# EAGLE schematic MSP-EXP430FR5739_1_1_4 (EAGLE 6.2)
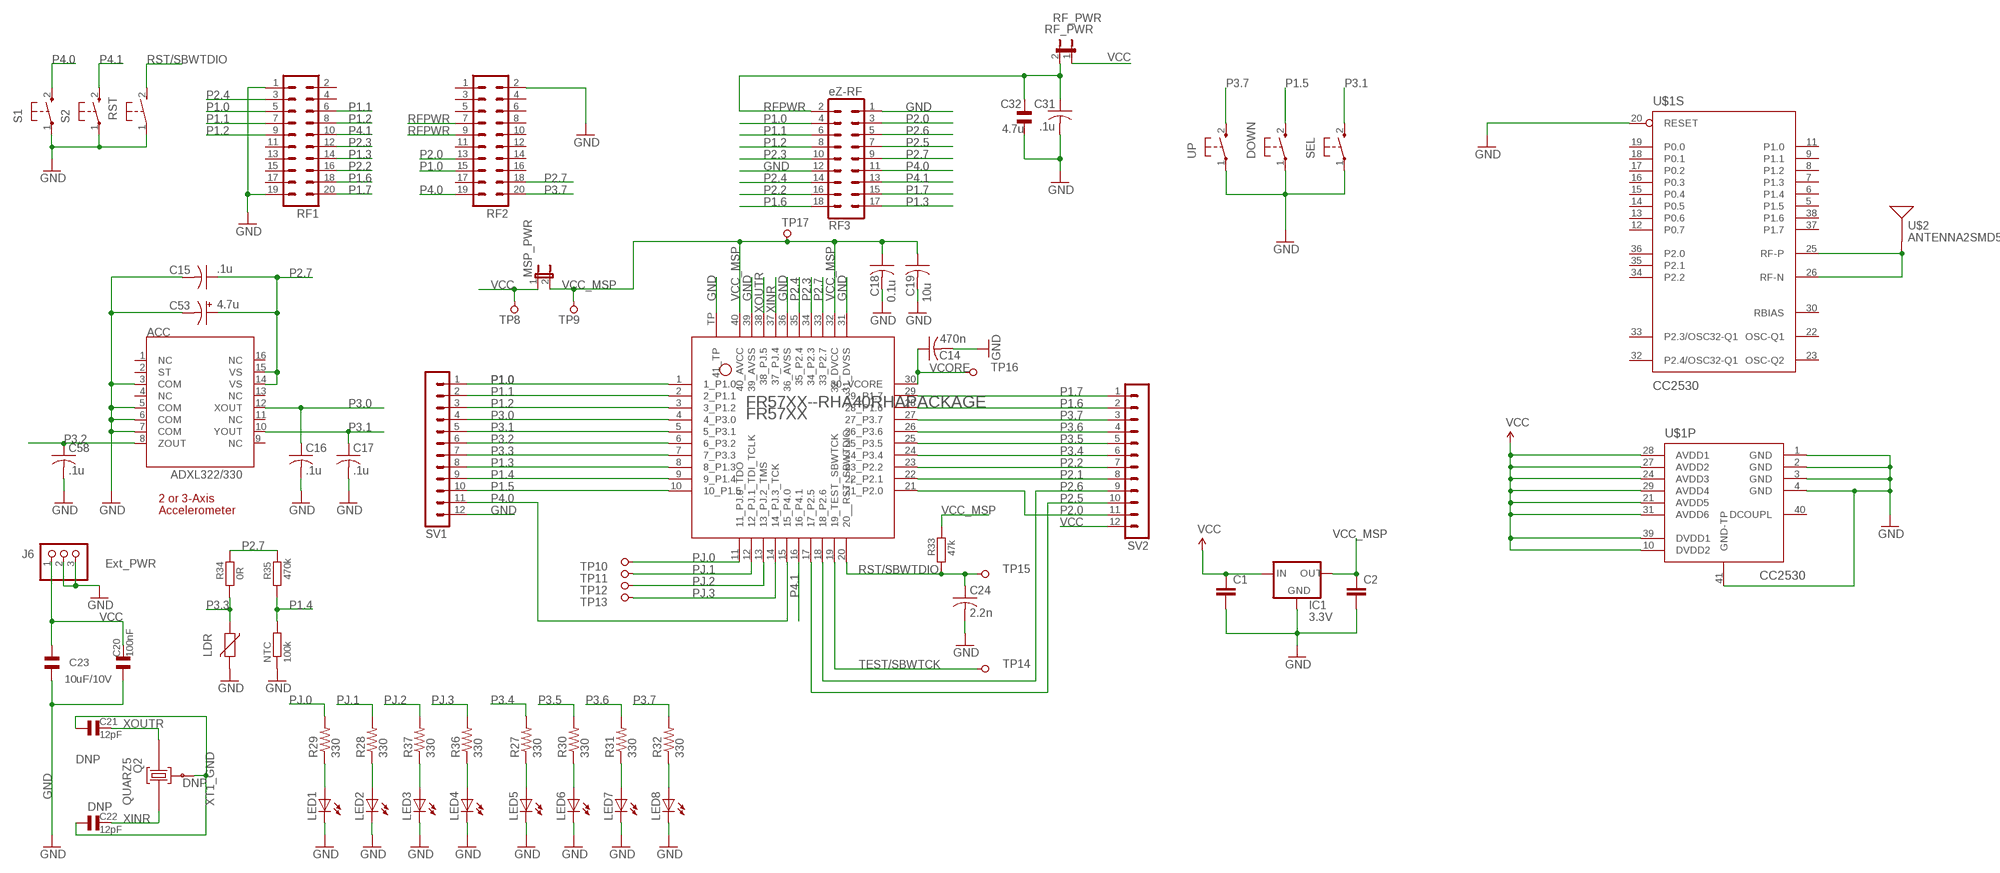
[diagram p0: schematic, sheet 1]

## Parts
ACC  ADXL322/330  ADXL330  [RSA16]
C1  CAPPTH1  [CAP-PTH-5MM]
C2  CAPPTH1  [CAP-PTH-5MM]
C14  470n  C-USC0603  [C0603]
C15  .1u  C-USC0603  [C0603]
C16  .1u  C-USC0603  [C0603]
C17  .1u  C-USC0603  [C0603]
C18  0.1u  C-USC0603  [C0603]
C19  10u  C-USC0603  [C0603]
C20  100nF  C_SMD0603  [0603]
C21  12pF  C_SMD0603  [0603]
C22  12pF  C_SMD0603  [0603]
C23  10uF/10V  C_0805  [0805]
C24  2.2n  C-USC0603  [C0603]
C31  .1u  C-USC0603  [C0603]
C32  4.7u  CSMD0805  [CSMD0805]
C53  4.7u  CPOL-USSMCA  [SMC_A]
C58  .1u  C-USC0603  [C0603]
DOWN  PB  [PBTH]
FR57XX  FR57XX--RHA40RHAPACKAGE  [RHA40]
IC1  3.3V  78LXX  [78LXX]
J6  PINHD-1X3  [1X03]
LDR  R3,4  [R-3,4]
LED1  LEDCHIPLED_0603  [CHIPLED_0603]
LED2  LEDCHIPLED_0603  [CHIPLED_0603]
LED3  LEDCHIPLED_0603  [CHIPLED_0603]
LED4  LEDCHIPLED_0603  [CHIPLED_0603]
LED5  LEDCHIPLED_0603  [CHIPLED_0603]
LED6  LEDCHIPLED_0603  [CHIPLED_0603]
LED7  LEDCHIPLED_0603  [CHIPLED_0603]
LED8  LEDCHIPLED_0603  [CHIPLED_0603]
MSP_PWR  JP1E  [JP1]
NTC  100k  R_0805  [0805]
Q2  QUARZ5  [QUARZ5]
R27  330  R-US_R0603  [R0603]
R28  330  R-US_R0603  [R0603]
R29  330  R-US_R0603  [R0603]
R30  330  R-US_R0603  [R0603]
R31  330  R-US_R0603  [R0603]
R32  330  R-US_R0603  [R0603]
R33  47k  R_SMDR0603  [0603]
R34  0R  R_SMDR0603  [0603]
R35  470k  R_SMDR0603  [0603]
R36  330  R-US_R0603  [R0603]
R37  330  R-US_R0603  [R0603]
RF1  TFM-110-02-SM-D-A-K  [TFM-110-02-SM-D-A-K]
RF2  TFM-110-02-SM-D-A-K  [TFM-110-02-SM-D-A-K]
RF3  eZ-RF  MA09-2  [MA09-2]
RF_PWR  RF_PWR  JP1E  [JP1]
RST  EVQPPDASTD  [EVQPPDA]
S1  PB  [PBTH]
S2  PB  [PBTH]
SEL  PB  [PBTH]
SV1  MA12-1  [MA12-1]
SV2  MA12-1  [MA12-1]
TP8  TP05TP10  [TP10]
TP9  TP05TP10  [TP10]
TP10  TP05TP10  [TP10]
TP11  TP05TP10  [TP10]
TP12  TP05TP10  [TP10]
TP13  TP05TP10  [TP10]
TP14  TP05TP10  [TP10]
TP15  TP05TP10  [TP10]
TP16  TP05TP10  [TP10]
TP17  TP05TP10  [TP10]
U$1  CC2530  [QFN50P600X600X100-41N]
U$2  ANTENNA2SMD5  [ANTENNA-CHIP5]
UP  PB  [PBTH]

## Nets
GND [Ground]: ACC.3(COM) ACC.5(COM) ACC.6(COM) ACC.7(COM) C1.2 C2.2 C14.2 C15.2 C16.2 C17.2 C18.2 C19.2 C20.1 C23.1 C24.2 C31.2 C32.2 C53.- C58.2 DOWN.1(P) FR57XX.31(31_DVSS) FR57XX.36(36_AVSS) FR57XX.39(39_AVSS) FR57XX.TP(41_TP) IC1.GND J6.2 J6.3 LDR.2 LED1.C LED2.C LED3.C LED4.C LED5.C LED6.C LED7.C LED8.C NTC.1 RF1.1 RF1.19 RF2.2 RF3.1 RF3.12 RST.1(P) S1.1(P) S2.1(P) SEL.1(P) SV1.12 U$1.1(GND) U$1.2(GND) U$1.3(GND) U$1.4(GND) U$1.20(RESET) U$1.41(GND-TP) UP.1(P)
N$1: U$1.25(RF-P) U$1.26(RF-N) U$2.FEED(SIGNAL)
N$7: LED6.A R30.1
N$8: LED7.A R31.1
N$10: LED5.A R27.1
N$11: LED8.A R32.1
N$12: LED2.A R28.1
N$13: LED1.A R29.1
N$18: LED4.A R36.1
N$23: LED3.A R37.1
P1.0: FR57XX.1(1_P1.0) RF1.5 RF2.15 RF3.4 SV1.1
P1.1: FR57XX.2(2_P1.1) RF1.6 RF1.7 RF3.6 SV1.2
P1.2: FR57XX.3(3_P1.2) RF1.8 RF1.9 RF3.8 SV1.3
P1.3: FR57XX.8(8_P1.3) RF1.14 RF3.17 SV1.8
P1.4: FR57XX.9(9_P1.4) NTC.2 R35.1 SV1.9
P1.5: DOWN.2(S) FR57XX.10(10_P1.5) SV1.10
P1.6: FR57XX.28(28_P1.6) RF1.18 RF3.18 SV2.2
P1.7: FR57XX.29(29_P1.7) RF1.20 RF3.15 SV2.1
P2.0: FR57XX.21(21_P2.0) RF2.13 RF3.3 SV2.11
P2.1: FR57XX.22(22_P2.1) SV2.8
P2.2: FR57XX.23(23_P2.2) RF1.16 RF3.16 SV2.7
P2.3: FR57XX.34(34_P2.3) RF1.12 RF3.10
P2.4: FR57XX.35(35_P2.4) RF1.3 RF3.14
P2.5: FR57XX.17(17_P2.5) RF3.7 SV2.10
P2.6: FR57XX.18(18_P2.6) RF3.5 SV2.9
P2.7: ACC.14(VS) ACC.15(VS) C15.1 C53.+ FR57XX.33(33_P2.7) R34.2 R35.2 RF2.18 RF3.9
P3.0: ACC.12(XOUT) C16.1 FR57XX.4(4_P3.0) SV1.4
P3.1: ACC.10(YOUT) C17.1 FR57XX.5(5_P3.1) SEL.2(S) SV1.5
P3.2: ACC.8(ZOUT) C58.1 FR57XX.6(6_P3.2) SV1.6
P3.3: FR57XX.7(7_P3.3) LDR.1 R34.1 SV1.7
P3.4: FR57XX.24(24_P3.4) R27.2 SV2.6
P3.5: FR57XX.25(25_P3.5) R30.2 SV2.5
P3.6: FR57XX.26(26_P3.6) R31.2 SV2.4
P3.7: FR57XX.27(27_P3.7) R32.2 RF2.20 SV2.3 UP.2(S)
P4.0: FR57XX.15(15_P4.0) RF2.19 RF3.11 S1.2(S) SV1.11
P4.1: FR57XX.16(16_P4.1) RF1.10 RF3.13 S2.2(S)
PJ.0: FR57XX.11(11_PJ.0_TDO) R29.2 TP10.1
PJ.1: FR57XX.12(12_PJ.1_TDI_TCLK) R28.2 TP11.1
PJ.2: FR57XX.13(13_PJ.2_TMS) R37.2 TP12.1
PJ.3: FR57XX.14(14_PJ.3_TCK) R36.2 TP13.1
RFPWR: C31.1 C32.1 RF2.7 RF2.9 RF3.2 RF_PWR.2
RST/SBWTDIO: C24.1 FR57XX.20(20__RST_SBWTDIO) R33.1 RST.2(S) TP15.1
TEST/SBWTCK: FR57XX.19(19_TEST_SBWTCK) TP14.1
VCC: C1.1 C20.2 C23.2 IC1.IN J6.1 MSP_PWR.1 RF_PWR.1 SV2.12 TP8.1 U$1.10(DVDD2) U$1.21(AVDD5) U$1.24(AVDD3) U$1.27(AVDD2) U$1.28(AVDD1) U$1.29(AVDD4) U$1.31(AVDD6) U$1.39(DVDD1)
VCC_MSP: C2.1 C18.1 C19.1 FR57XX.32(32_DVCC) FR57XX.40(40_AVCC) IC1.OUT MSP_PWR.2 R33.2 TP9.1 TP17.1
VCORE: C14.1 FR57XX.30(30_VCORE) TP16.1
XINR: C22.2 FR57XX.37(37_PJ.4) Q2.1
XOUTR: C21.2 FR57XX.38(38_PJ.5) Q2.2
XT1_GND: C21.1 C22.1 Q2.GND@0
Unconnected: ACC.1(NC) ACC.2(ST) ACC.4(NC) ACC.9(NC) ACC.11(NC) ACC.13(NC) ACC.16(NC) RF1.2 RF1.4 RF1.11 RF1.13 RF1.15 RF1.17 RF2.1 RF2.3 RF2.4 RF2.5 RF2.6 RF2.8 RF2.10 RF2.11 RF2.12 RF2.14 RF2.16 RF2.17 U$1.5(P1.5) U$1.6(P1.4) U$1.7(P1.3) U$1.8(P1.2) U$1.9(P1.1) U$1.11(P1.0) U$1.12(P0.7) U$1.13(P0.6) U$1.14(P0.5) U$1.15(P0.4) U$1.16(P0.3) U$1.17(P0.2) U$1.18(P0.1) U$1.19(P0.0) U$1.22(OSC-Q1) U$1.23(OSC-Q2) U$1.30(RBIAS) U$1.32(P2.4/OSC32-Q1) U$1.33(P2.3/OSC32-Q1) U$1.34(P2.2) U$1.35(P2.1) U$1.36(P2.0) U$1.37(P1.7) U$1.38(P1.6)

## Notes on the sheet
- 2 or 3-Axis
- Accelerometer
- Ext_PWR
- DNP
- DNP
- DNP

## Power pins joined to a net without a drawn wire
DCOUPL: U$1.40(DCOUPL)

## Library data of the parts
ACC = _5438_ATC:ADXL330
C1 C2 = SparkFun:CAP: Capacitor Standard 0603 ceramic capacitor, and 0.1" leaded capacitor.
C14-C19 C24 C31 C58 = rcl:C-US: CAPACITOR, American symbol
C20-C22 = ssmd:C_SMD
C23 = ssmd:C_0805
C32 = CAP:CSMD0805
C53 = rcl:CPOL-US: POLARIZED CAPACITOR, American symbol
DOWN S1 S2 SEL UP = electricalmeter:PB: OMRON SWITCH
FR57XX = TI_MSP430_v16_intern:FR57XX--RHA40: *** MSP430FR57xx *** 40-PIN RHA (QFN) ***
IC1 = v-reg:78LXX: VOLTAGE REGULATOR
J6 = pinhead:PINHD-1X3: PIN HEADER
LDR = varistor:R3,4
LED1-LED8 = led:LED: LED OSRAM: - CHIPLED LG R971, LG N971, LY N971, LG Q971, LY Q971, LO R971, LY R971 LH N974, LH R974 LS Q976, LO Q976, LY Q976 LO Q996 - Hyper CHIPLED LW Q18S LB Q993, LB Q99A, LB R99A - SideLED LS A670, LO A670, LY A670, LG A670, LP A670 LB A673, LV A673, LT A673, LW A673 LH A674 LY A675 LS A676, LA A676, LO A676, LY A676, LW A676 LS A679, LY A679, LG A679 - Hyper Micro SIDELED® LS Y876, LA Y876, LO Y876, LY Y876 LT Y87S - SmartLED LW L88C, LW L88S LB L89C, LB L89S, LG L890 LS L89K, LO L89K, LY L89K LS L896, LA L896, LO L896, LY L896 - TOPLED LS T670, LO T670, LY T670, LG T670, LP T670 LSG T670, LSP T670, LSY T670, LOP T670, LYG T670 LG T671, LOG T671, LSG T671 LB T673, LV T673, LT T673, LW T673 LH T674 LS T676, LA T676, LO T676, LY T676, LB T676, LH T676, LSB T676, LW T676 LB T67C, LV T67C, LT T67C, LS T67K, LO T67K, LY T67K, LW E67C LS E67B, LA E67B, LO E67B, LY E67B, LB E67C, LV E67C, LT E67C LW T67C LS T679, LY T679, LG T679 LS T770, LO T770, LY T770, LG T770, LP T770 LB T773, LV T773, LT T773, LW T773 LH T774 LS E675, LA E675, LY E675, LS T675 LS T776, LA T776, LO T776, LY T776, LB T776 LHGB T686 LT T68C, LB T68C - Hyper Mini TOPLED® LB M676 - Mini TOPLED Santana® LG M470 LS M47K, LO M47K, LY M47K Source: http://www.osram.convergy.de/
MSP_PWR RF_PWR = jumper:JP1E: JUMPER
NTC = smd:R_0805
Q2 = sMSP430:QUARZ5
R27-R32 R36 R37 = rcl:R-US_: RESISTOR, American symbol
R33-R35 = ssmd:R_SMD
RF1 RF2 = _MSP430_RF:TFM-110-02-SM-D-A-K
RF3 = con-lstb:MA09-2: PIN HEADER
RST = MSP430:EVQPPDA
SV1 SV2 = con-lstb:MA12-1: PIN HEADER
TP8-TP17 = usbfet:TP05
U$1 = chipcon-ti-v2:CC2530: A True System-on-Chip Solution for 2.4-GHz IEEE 802.15.4 and ZigBee Applications
U$2 = SparkFun:ANTENNA2: Antenna Single endded antenna. Common with smaller chip antennas. CHIP4 package is the GPS Chip Antenna SKU: GPS-08418. CHIP5 package is 2.4GHz chip antenna SKU: WRL-00144.

## Net classes
0 default: width 0.1 mm, drill 0.2 mm
1 Ground: width 0.203 mm, drill 0.61 mm
2 Power: width 0.406 mm, drill 0.305 mm, clearance 0.152 mm to class 0, clearance 0.152 mm to class 1, clearance 0.152 mm